# Altium schematic sheet ORD_CONNECTORS.SchDoc
size 420 x 297 mm; Address1: Address1; Address2: Address2; Address3: Address3; Address4: Address4; DocumentNumber: АБВГ.123456.001 Э3; SheetNumber: 1; Scale: 1:1; DocumentType: Схема электрическая принципиальная; FirstReferrence: АБВГ.123456.001
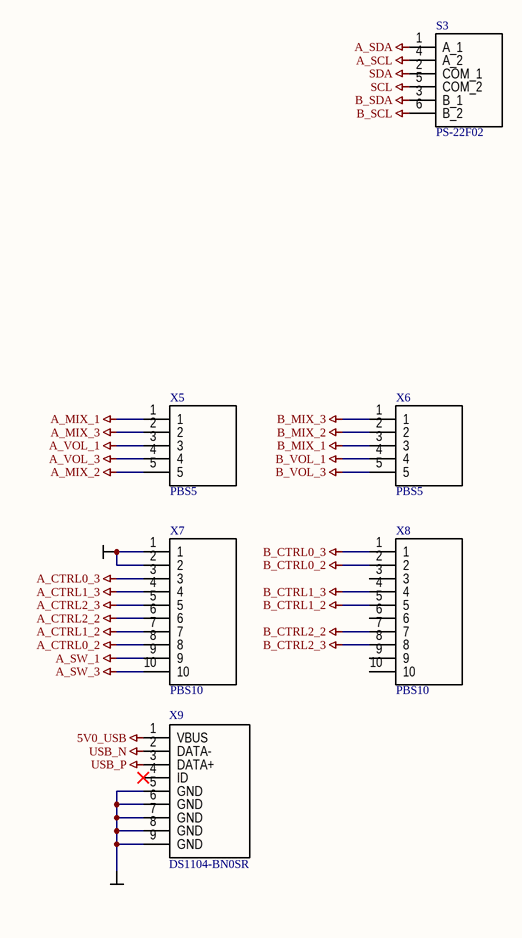
[diagram p0: ORD_CONNECTORS.SchDoc]

## Parts
S3  PS-22F02  [PS-22F02]
X5  PBS5  [pbs-5]
X6  PBS5  [pbs-5]
X7  PBS10  [PBS-10]
X8  PBS10  [PBS-10]
X9  DS1104-BN0SR  [DS1104-BN0SR]

## Nets
5V0_USB: X9.1(VBUS)
A_CTRL0_2: X7.8
A_CTRL0_3: X7.3
A_CTRL1_2: X7.7
A_CTRL1_3: X7.4
A_CTRL2_2: X7.6
A_CTRL2_3: X7.5
A_MIX_1: X5.1
A_MIX_2: X5.5
A_MIX_3: X5.2
A_SCL: S3.4(A_2)
A_SDA: S3.1(A_1)
A_SW_1: X7.9
A_SW_3: X7.10
A_VOL_1: X5.3
A_VOL_3: X5.4
B_CTRL0_2: X8.2
B_CTRL0_3: X8.1
B_CTRL1_2: X8.5
B_CTRL1_3: X8.4
B_CTRL2_2: X8.7
B_CTRL2_3: X8.8
B_MIX_1: X6.3
B_MIX_2: X6.2
B_MIX_3: X6.1
B_SCL: S3.6(B_2)
B_SDA: S3.3(B_1)
B_VOL_1: X6.4
B_VOL_3: X6.5
GND: X7.1 X7.2 X9.5(GND) X9.6(GND) X9.7(GND) X9.8(GND) X9.9(GND)
SCL: S3.5(COM_2)
SDA: S3.2(COM_1)
USB_N: X9.2(DATA-)
USB_P: X9.3(DATA+)

Not connected (* = marked no-connect by the designer): X8 3 6 9 10; X9 4(ID)*

## Notes on the sheet
- Перв. примен.
- Справ. №
- Подп. и дата
- Инв. № дубл.
- Взам. инв. №
- Разраб.
- Изм.
- Лист
- № докум.
- Подп.
- Дата
- Лит.
- Масса
- Масштаб
- Пров.
- Т.контр.
- Листов
- Инв. № подл.
- Утв.
- Н.контр.
- 2.106-A3
- Копировал
- Формат А3

## Library data of the parts
S3 = PS-22F02: Switch 6-pin; Manufacturer_Name: Switronic; Manufacturer_Part_Number: IS-2235; Geometry.Height: 5mm; Mouser Part Number: *; Mouser Price/Stock: *; RS Part Number: *; RS Price/Stock: *; Datasheet Link: http://www.switronic.com/gallery/detail/400
X5 X6 = PBS5: 2.54 mm; System: Connector
X7 X8 = PBS10: 2.54 mm; System: Connector
X9 = DS1104-BN0SR: MINI USB Connector; Manufacturer_Name: Connfly; Geometry.Height: 3.95mm; Manufacturer_Part_Number: DS1104-BN0SR; Mouser Part Number: *; Mouser Price/Stock: *; RS Part Number: *; RS Price/Stock: *; Datasheet Link: https://www.tme.eu/en/Document/609ffd1fdbc4bea9351dc791fd9a9696/musb-g5p.pdf